# EAGLE design power-volume-video-switching (EAGLE 9.1.0)
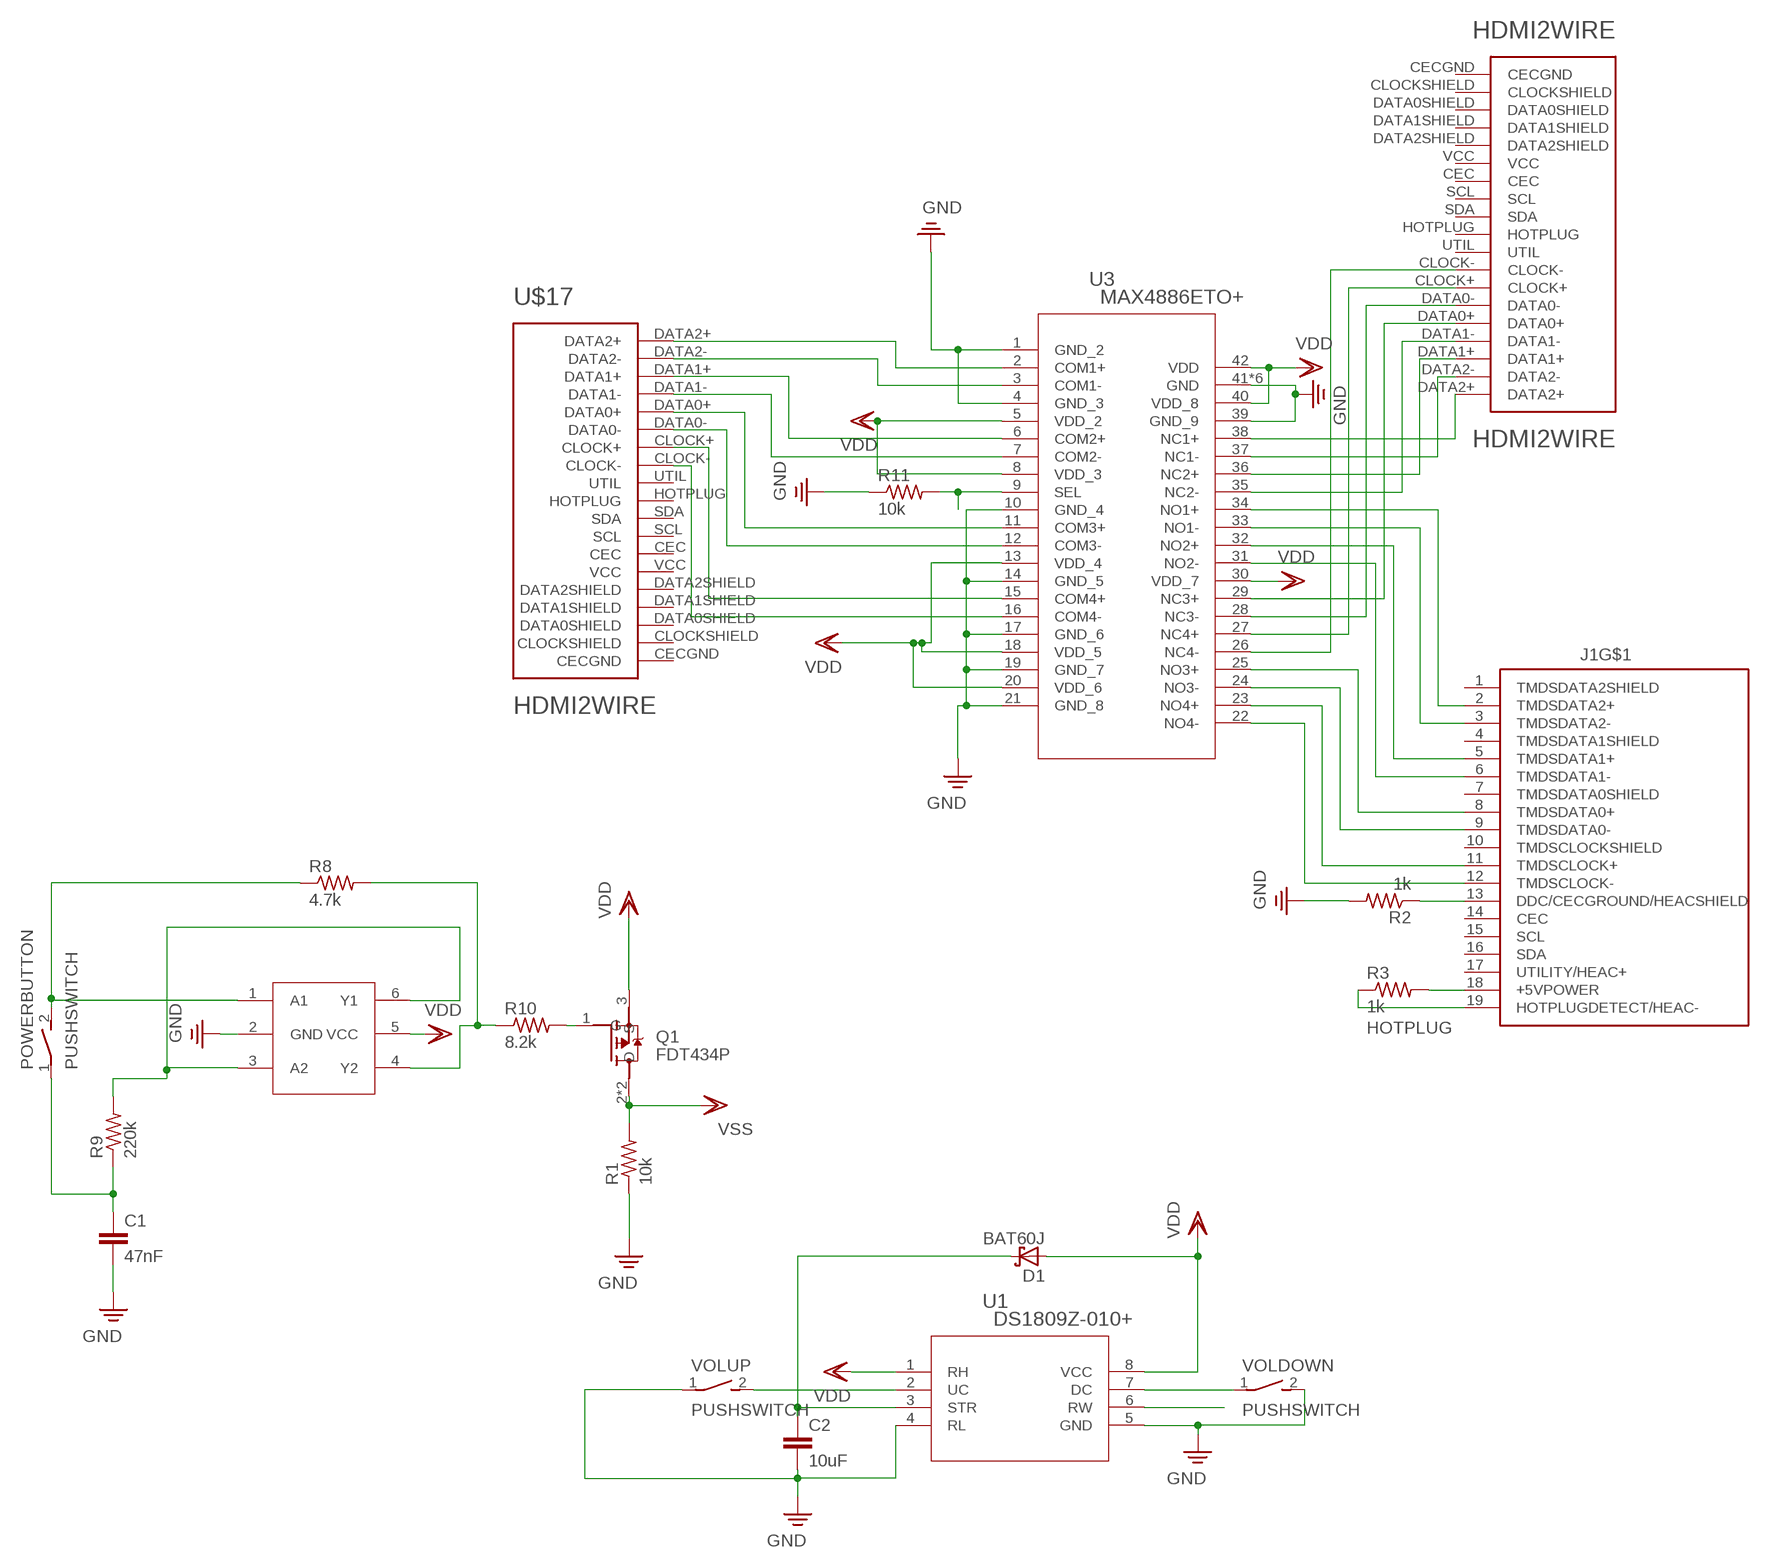
[diagram p0: schematic, sheet 1]

## Parts
C1  47nF  C-EUC0603  [C0603]
C2  10uF  C-EUC0603  [C0603]
D1  BAT60J  [SOD323_ST]
HDMI2WIRE  HDMI2WIRE  [HDMI]
J1  685119136923  [685119136923]
POWERBUTTON  PUSHSWITCH  [PUSHSWITCH]
Q1  FDT434P  [SOT230P700X180-4N]
R1  10k  R-US_R0603  [R0603]
R2  1k  R-US_R0603  [R0603]
R3  1k  R-US_R0603  [R0603]
R8  4.7k  R-US_R0603  [R0603]
R9  220k  R-US_R0603  [R0603]
R10  8.2k  R-US_R0603  [R0603]
R11  10k  R-US_R0603  [R0603]
U1  DS1809Z-010+  [21-0041B_8]
U2  NC7WZ14P6X  [SC70-6L]
U3  MAX4886ETO+  [21-0181B_T423590M-1]
U$17  HDMI2WIRE  [HDMI]
VOLDOWN  PUSHSWITCH  [PUSHSWITCH]
VOLUP  PUSHSWITCH  [PUSHSWITCH]

## Nets
HOTPLUG: J1.19(HOTPLUGDETECT/HEAC-) R3.1 R11.2 U3.9(SEL)
N$1: C2.1 D1.C U1.3(STR)
N$2: U1.2(UC) VOLUP.2(S)
N$3: R9.2 U2.3(A2) U2.6(Y1)
N$4: POWERBUTTON.2(S) R8.1 U2.1(A1)
N$5: J1.2(TMDSDATA2+) U3.34(NO1+)
N$6: U1.7(DC) VOLDOWN.1(P)
N$7: J1.3(TMDSDATA2-) U3.33(NO1-)
N$8: J1.5(TMDSDATA1+) U3.32(NO2+)
N$9: R8.2 R10.1 U2.4(Y2)
N$10: J1.6(TMDSDATA1-) U3.31(NO2-)
N$11: C1.1 POWERBUTTON.1(P) R9.1
N$12: J1.8(TMDSDATA0+) U3.25(NO3+)
N$13: J1.9(TMDSDATA0-) U3.24(NO3-)
N$14: Q1.1(G) R10.2
N$15: J1.11(TMDSCLOCK+) U3.23(NO4+)
N$16: J1.12(TMDSCLOCK-) U3.22(NO4-)
N$17: U3.2(COM1+) U$17.DATA2+
N$18: J1.13(DDC/CECGROUND/HEACSHIELD) R2.1
N$19: U3.3(COM1-) U$17.DATA2-
N$20: J1.18(+5VPOWER) R3.2
N$21: U3.6(COM2+) U$17.DATA1+
N$22: U3.7(COM2-) U$17.DATA1-
N$23: U3.11(COM3+) U$17.DATA0+
N$24: U3.12(COM3-) U$17.DATA0-
N$25: U3.15(COM4+) U$17.CLOCK+
N$26: U3.16(COM4-) U$17.CLOCK-
N$38: HDMI2WIRE.DATA2+ U3.38(NC1+)
N$39: HDMI2WIRE.DATA2- U3.37(NC1-)
N$40: HDMI2WIRE.DATA1+ U3.36(NC2+)
N$41: HDMI2WIRE.DATA1- U3.35(NC2-)
N$42: HDMI2WIRE.DATA0+ U3.29(NC3+)
N$43: HDMI2WIRE.DATA0- U3.28(NC3-)
N$44: HDMI2WIRE.CLOCK+ U3.27(NC4+)
N$45: HDMI2WIRE.CLOCK- U3.26(NC4-)
PE: C1.2 C2.2 R1.1 R2.2 R11.1 U1.4(RL) U1.5(GND) U2.2(GND) U3.1(GND_2) U3.4(GND_3) U3.10(GND_4) U3.14(GND_5) U3.17(GND_6) U3.19(GND_7) U3.21(GND_8) U3.39(GND_9) U3.41(GND) U3.43(GND) U3.P$1(GND) U3.P$2(GND) U3.P$3(GND) U3.P$4(GND) VOLDOWN.2(S) VOLUP.1(P) ; supply symbol labelled GND
VDD: D1.A Q1.3(S) U1.1(RH) U1.8(VCC) U2.5(VCC) U3.5(VDD_2) U3.8(VDD_3) U3.13(VDD_4) U3.18(VDD_5) U3.20(VDD_6) U3.30(VDD_7) U3.40(VDD_8) U3.42(VDD)
VSS: Q1.2(D) Q1.4(D) R1.2
WIPER: U1.6(RW)
Unconnected: HDMI2WIRE.CEC HDMI2WIRE.CECGND HDMI2WIRE.CLOCKSHIELD HDMI2WIRE.DATA0SHIELD HDMI2WIRE.DATA1SHIELD HDMI2WIRE.DATA2SHIELD HDMI2WIRE.HOTPLUG HDMI2WIRE.SCL HDMI2WIRE.SDA HDMI2WIRE.UTIL HDMI2WIRE.VCC J1.1(TMDSDATA2SHIELD) J1.4(TMDSDATA1SHIELD) J1.7(TMDSDATA0SHIELD) J1.10(TMDSCLOCKSHIELD) J1.14(CEC) J1.15(SCL) J1.16(SDA) J1.17(UTILITY/HEAC+) J1.SHELL1(SHIELD) J1.SHELL2(SHIELD) J1.SHELL3(SHIELD) J1.SHELL(SHIELD) U$17.CEC U$17.CECGND U$17.CLOCKSHIELD U$17.DATA0SHIELD U$17.DATA1SHIELD U$17.DATA2SHIELD U$17.HOTPLUG U$17.SCL U$17.SDA U$17.UTIL U$17.VCC

## Library data of the parts
C1 = resistor:C-EU: CAPACITOR, European symbol
C2 = rcl:C-EU: CAPACITOR, European symbol; SPICEPREFIX: C
D1 = diode:BAT60J: Schottky barrier diode Source: www.st.com, BAT60J.pdf
HDMI2WIRE U$17 = wiip:HDMI2WIRE
J1 = InputOutputIO (rev18a):685119136923: WR-COM SMT Horizontal Mini HDMI, 19 pins=>Code : Con_I-O_COM_Mini-HDMI_685119136923 <http://katalog.we-online.de/media/images/eican/Con_I-O_COM_Mini-HDMI_685119136923_pf2.jpg> Details see: http://katalog.we-online.de/en/em/COM_MINI_SMT_HORIZONTAL/685119136923 Created 2014-07-09, Karrer Zheng 2014 (C) Würth Elektronik
POWERBUTTON VOLDOWN VOLUP = wiip:PUSHSWITCH
Q1 = FDT434P:FDT434P: P-Channel 20 V 0.05 Ohm PowerTrench Mosfet - SOT-223; DESCRIPTION: P-Channel 20 V 0.05 Ohm PowerTrench Mosfet - SOT-223; DIGI-KEY_PART_NUMBER: FDT434PCT-ND; DIGI-KEY_PURCHASE_URL: https://www.digikey.com/product-detail/en/on-semiconductor/FDT434P/FDT434PCT-ND/1849925?utm_source=snapeda&utm_medium=aggregator&utm_campaign=symbol; MF: ON Semiconductor; MP: FDT434P; PACKAGE: TO-261-4 ON Semiconductor
R1-R3 R8-R11 = rcl:R-US_: RESISTOR, American symbol; SPICEPREFIX: R
U1 = DS1809Z-010+:DS1809Z-010+; MANUFACTURER_PART_NUMBER: DS1809Z010+; VENDOR: Maxim Integrated Products
U2 = wiip:NC7WZ14P6X
U3 = MAX4886:MAX4886ETO+; MANUFACTURER_PART_NUMBER: MAX4886ETO+; VENDOR: Maxim Integrated Products

## Net classes
0 default: width 0.178 mm, drill 0.254 mm, clearance 0.178 mm

## Board
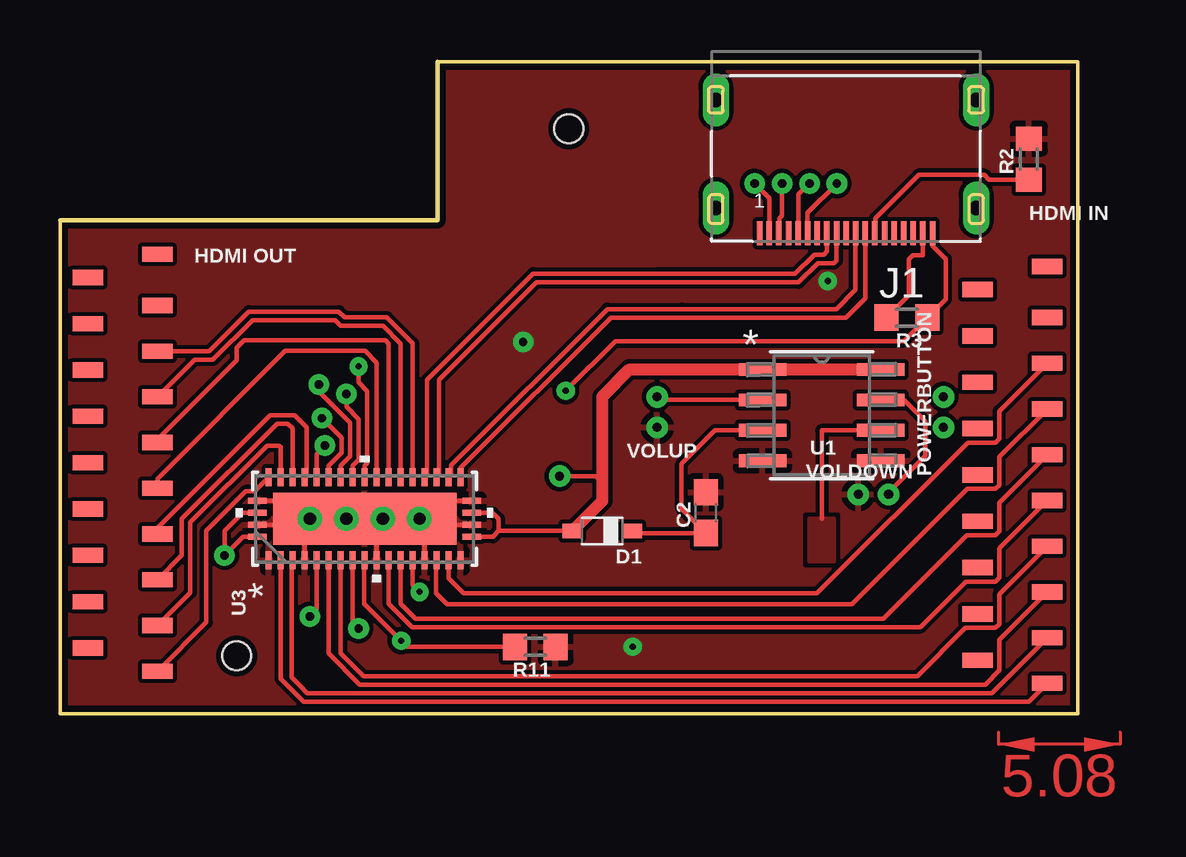
[diagram p1: board, top side]
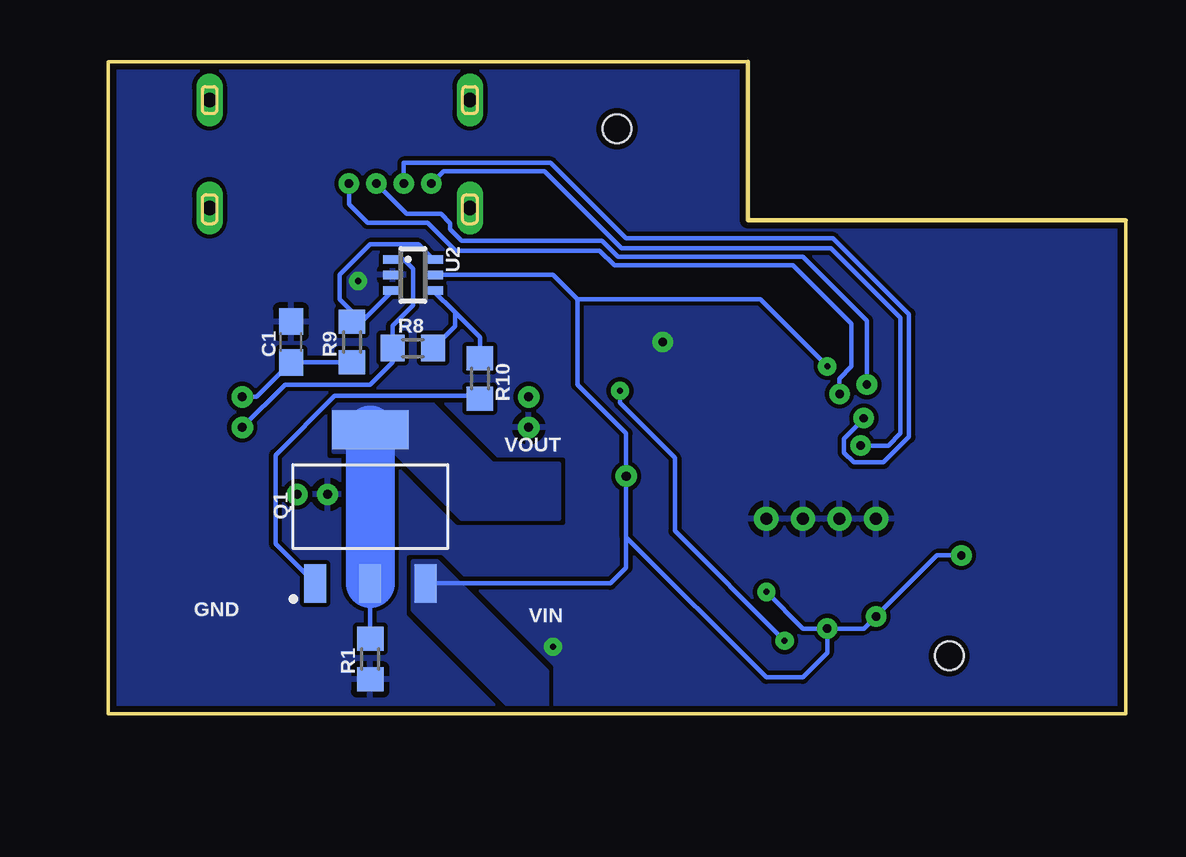
[diagram p2: board, bottom side, seen from below]

Size 42.42 x 27.18 mm. Coordinates in mm from the lower left corner, seen from the top.
Outline: 15.75,27.18 42.42,27.18 42.42,0 0,0 0,20.57 15.75,20.57 15.75,27.18
Copper layers (1*16): Top 0.035mm / dielectric 1.5mm / Bottom 0.035mm
Design rules "oshpark_mini_hdmi *": minimum track width 7mil, minimum drill 10mil, track to track 6mil, track to pad 6mil, pad to pad 7mil, via to via 6mil, smd to smd 4mil, copper to edge 10mil, drill to drill 7mil, minimum pad ring 10mil, minimum via ring 10mil, stop-mask expansion 2mil, vias tented up to drill 0mil, thermal gap 10mil
Holes 1.19 mm at 7.37,2.41 21.21,24.38

### Footprints (pad centres in the part's own frame; a part is rotated, then mirrored left to right if it is on the bottom)
C0603 = smd 1.1 x 1: 1 -0.85,0; 2 0.85,0
SOD323_ST = smd 0.8 x 0.6: A 1.25,0; C -1.25,0
HDMI = smd 1.27 x 0.635: CEC 2.896,-4.826; CECGND 2.896,-16.408; CLOCK+ 0,-11.43; CLOCK- 0,-13.335; CLOCKSHIELD 2.896,-14.478; DATA0+ 0,-7.62; DATA0- 0,-9.525; DATA0SHIELD 2.896,-12.548; DATA1+ 0,-3.81; DATA1- 0,-5.715; DATA1SHIELD 2.896,-10.617; DATA2+ 0,0; DATA2- 0,-1.905; DATA2SHIELD 2.896,-8.687; HOTPLUG 0,-17.374; SCL 2.896,-2.896; SDA 2.896,-0.965; UTIL 0,-15.24; VCC 2.896,-6.756
685119136923 = smd 0.23 x 1: 1 3.6,1.05; 2 3.2,1.05; 3 2.8,1.05; 4 2.4,1.05; 5 2,1.05; 6 1.6,1.05; 7 1.2,1.05; 8 0.8,1.05; 9 0.4,1.05; 10 0,1.05; 11 -0.4,1.05; 12 -0.8,1.05; 13 -1.2,1.05; 14 -1.6,1.05; 15 -2,1.05; 16 -2.4,1.05; 17 -2.8,1.05; 18 -3.2,1.05; 19 -3.6,1.05 | drill 0.6 long: SHELL -5.425,0; SHELL1 5.425,0; SHELL2 -5.425,-4.5; SHELL3 5.425,-4.5
PUSHSWITCH = drill 0.381: 1 0,0; 2 1.27,0
SOT230P700X180-4N = smd 0.92 x 1.61: 1 -2.3,-3.2; 2 0,-3.2; 3 2.3,-3.2 | smd 3.19 x 1.61: 4 0,3.2
R0603 = smd 1 x 1.1: 1 -0.85,0; 2 0.85,0
21-0041B_8 = smd 1.981 x 0.533: 1 -2.464,1.905; 2 -2.464,0.635; 3 -2.464,-0.635; 4 -2.464,-1.905; 5 2.464,-1.905; 6 2.464,-0.635; 7 2.464,0.635; 8 2.464,1.905
SC70-6L = smd 0.35 x 0.8: 1 -0.65,-0.85; 2 0,-0.85; 3 0.65,-0.85; 4 0.65,0.85; 5 0,0.85; 6 -0.65,0.85
21-0181B_T423590M-1 = smd 0.762 x 0.254: 1 -1.727,4; 2 -1.727,3.5; 3 -1.727,3; 4 -1.727,2.5; 5 -1.727,2; 6 -1.727,1.5; 7 -1.727,1; 8 -1.727,0.5; 9 -1.727,0; 10 -1.727,-0.5; 11 -1.727,-1; 12 -1.727,-1.5; 13 -1.727,-2; 14 -1.727,-2.5; 15 -1.727,-3; 16 -1.727,-3.5; 17 -1.727,-4; 22 1.727,-4; 23 1.727,-3.5; 24 1.727,-3; 25 1.727,-2.5; 26 1.727,-2; 27 1.727,-1.5; 28 1.727,-1; 29 1.727,-0.5; 30 1.727,0; 31 1.727,0.5; 32 1.727,1; 33 1.727,1.5; 34 1.727,2; 35 1.727,2.5; 36 1.727,3; 37 1.727,3.5; 38 1.727,4 | smd 0.254 x 0.762: 18 -0.75,-4.47; 19 -0.25,-4.47; 20 0.25,-4.47; 21 0.75,-4.47; 39 0.75,4.47; 40 0.25,4.47; 41 -0.25,4.47; 42 -0.75,4.47 | smd 2.159 x 7.645: 43 0,0 | drill 0.508: P$1 0,2.286; P$2 0,0.762; P$3 0,-0.762; P$4 0,-2.286

### Placement (x,y rotation side)
C1  34.8,15.49 90 bottom
C2  26.92,8.38 90 top
D1  22.61,7.62 180 top
HDMI2WIRE  4.06,1.78 180 top
J1  32.77,21.08 180 top
POWERBUTTON  36.83,13.21 270 bottom
Q1  31.5,8.64 0 bottom
R1  31.5,2.29 90 bottom
R2  40.39,23.11 90 top
R3  35.31,16.51 180 top
R8  29.72,15.24 0 bottom
R9  32.26,15.49 90 bottom
R10  26.92,13.97 270 bottom
R11  19.81,2.79 180 top
U1  31.75,12.45 0 top
U2  29.72,18.29 270 bottom
U3  12.7,8.13 90 top
U$17  41.15,1.27 180 top
VOLDOWN  34.54,9.14 180 top
VOLUP  24.89,11.94 90 bottom

### Tracks (layer width: path | path; a pad name or v marks a point on that pad's centre or on a via)
HOTPLUG  (via drill 0.25)
  Top 0.178: R11.2 14.48,2.79 v14.22,3.05 12.68,4.6 12.68,6.38 U3.9 | v21.08,13.46 23.15,15.53 35.18,15.53 R3.1 36.92,17.28 36.92,18.95 36.37,19.5 J1.19
  Bottom 0.178: v21.08,13.46 21.08,12.95 18.8,10.67 18.8,7.62 v14.22,3.05
N$1
  Top 0.178: U1.3 27.31,11.81 25.91,10.41 25.91,8.55 C2.1 23.94,7.53 D1.C
N$2
  Top 0.178: U1.2 25.02,13.08 VOLUP.2
N$3
  Bottom 0.178: R9.2 31.86,16.34 | 31.86,16.34 R9.2 | U2.6 29.49,19.56 31.5,19.56 32.77,18.29 32.77,17.27 32.26,16.76 R9.2 | U2.3 31.86,16.34 | 31.86,16.34 R9.2
N$4
  Bottom 0.178: U2.1 30.11,18.94 29.72,18.54 29.72,17.02 30.57,16.17 R8.1 30.57,14.64 31.5,13.72 35.05,13.72 POWERBUTTON.2
N$5  (via drill 0.35)
  Top 0.178: U3.34 10.7,10.83 v11.05,11.18 | v28.96,22.1 29.57,21.49 J1.2
  Bottom 0.178: v11.05,11.18 9.91,11.18 9.4,11.68 9.4,16.5 12.3,19.41 21.03,19.41 24.23,22.61 28.45,22.61 v28.96,22.1
N$6
  Top 0.178: U1.7 35.18,13.08 36.07,12.19 36.07,10.76 34.54,9.24 VOLDOWN.1
N$7  (via drill 0.35)
  Top 0.178: U3.33 11.2,10.34 11.75,10.89 11.75,11.5 v10.92,12.32 | J1.3 29.98,20.05 29.98,20.64 30.1,20.76 v30.1,22.1
  Bottom 0.178: v10.92,12.32 10.92,12.29 11.75,11.46 11.75,10.89 11.34,10.48 10.1,10.48 9.04,11.54 9.04,16.65 12.2,19.81 20.83,19.81 23.98,22.96 30.1,22.96 v30.1,22.1
N$8  (via drill 0.35)
  Top 0.178: U3.32 11.7,10.34 12.1,10.74 12.1,12.12 10.8,13.43 v10.8,13.72 | J1.5 30.78,20.05 30.78,21.64 v31.24,22.1
  Bottom 0.178: v10.8,13.72 10.8,16.38 13.46,19.05 21.18,19.05 21.83,19.71 27.68,19.71 28.16,20.19 28.16,20.44 28.55,20.83 29.97,20.83 v31.24,22.1
N$9
  Bottom 0.178: U2.4 27.97,16.74 | 27.97,16.74 26.92,15.69 R10.1 | R8.2 27.97,16.14 27.97,16.74
N$10  (via drill 0.35)
  Top 0.178: v11.94,13.33 11.94,12.79 12.46,12.27 12.46,10.59 12.2,10.34 U3.31 | v32.39,22.1 31.17,20.88 J1.6
  Bottom 0.178: v11.94,13.33 11.94,13.97 11.43,14.48 11.43,16.26 13.87,18.69 21.32,18.69 21.93,19.3 27.94,19.3 29.11,20.47 31.62,20.47 32.39,21.24 v32.39,22.1
N$11
  Bottom 0.178: R9.1 C1.1 36.23,13.21 POWERBUTTON.1
N$12
  Top 0.178: U3.25 15.31,9.96 15.31,13.92 19.72,18.34 24.89,18.34 30.64,18.34 31.44,19.14 31.84,19.14 31.97,19.27 J1.8
N$13
  Top 0.178: U3.24 15.81,9.96 15.81,13.92 19.87,17.98 30.79,17.98 31.59,18.78 32.26,18.78 32.37,18.89 J1.9
N$14
  Bottom 0.178: R10.2 27.05,13.25 32.98,13.25 35.45,10.78 35.45,7.87 35.45,7.09 Q1.1
N$15
  Top 0.178: U3.23 16.31,9.96 16.31,10.36 22.81,16.87 25.91,16.87 32.37,16.87 33.17,17.66 J1.11
N$16
  Top 0.178: U3.22 16.7,10.25 22.96,16.51 32.77,16.51 33.57,17.31 J1.12
N$17
  Top 0.178: U3.2 9.2,1.47 10.16,0.51 40.39,0.51 U$17.DATA2+
N$18
  Top 0.178: R2.1 38.72,22.26 38.53,22.46 35.8,22.46 33.98,20.64 33.98,20.05 J1.13
N$19
  Top 0.178: U$17.DATA2- 40.07,2.1 38.84,0.86 10.31,0.86 10.03,1.14 9.65,1.52 9.65,6.35 U3.3
N$20
  Top 0.178: J1.18 35.97,19.11 35.55,19.11 35.39,18.95 35.39,17.44 R3.2
N$21
  Top 0.178: U3.6 11.2,2.52 12.5,1.22 38.57,1.22 39.15,1.81 39.15,3.09 U$17.DATA1+
N$22
  Top 0.178: U3.7 11.7,2.52 12.65,1.57 35.74,1.57 37.74,3.58 39,3.58 39.15,3.74 39.15,4.99 U$17.DATA1-
N$23
  Top 0.178: U3.11 13.7,4.59 14.68,3.61 35.87,3.61 37.77,5.51 39,5.51 39.15,5.67 39.15,6.9 U$17.DATA0+
N$24
  Top 0.178: U3.12 14.2,4.59 14.83,3.97 34.32,3.97 37.8,7.44 39,7.44 39.15,7.6 39.15,8.8 U$17.DATA0-
N$25
  Top 0.178: U$17.CLOCK+ 39.15,10.71 39.15,9.53 39,9.37 37.82,9.37 33.02,4.57 17.27,4.57 16.13,4.57 15.68,5.02 15.68,6.38 U3.15
N$26
  Top 0.178: U$17.CLOCK- 39.15,12.61 39.15,11.46 39,11.3 37.85,11.3 31.56,5.02 16.83,5.02 16.2,5.64 U3.16
N$38
  Top 0.178: U3.38 8.12,9.27 7.74,9.27 6.1,7.63 6.1,3.81 HDMI2WIRE.DATA2+
N$39
  Top 0.178: HDMI2WIRE.DATA2- 5.44,5.05 5.44,7.98 8.63,11.18 9.14,11.18 9.2,11.12 U3.37
N$40
  Top 0.178: HDMI2WIRE.DATA1+ 5.08,6.6 5.08,8.13 9.04,12.09 9.5,12.09 9.7,11.89 U3.36
N$41
  Top 0.178: U3.35 10.27,9.93 10.27,11.95 9.78,12.45 8.76,12.45 4.06,7.75 HDMI2WIRE.DATA1-
N$42
  Top 0.178: 12.71,15.13 12.7,15.13 | 12.7,15.13 9.38,15.13 4.06,9.81 HDMI2WIRE.DATA0+ | 12.7,15.13 12.71,15.13 | 12.71,15.13 13.21,14.63 U3.29
N$43
  Top 0.178: U3.28 13.7,15.43 13.57,15.56 7.68,15.56 7.36,15.24 7.36,14.74 4.06,11.44 HDMI2WIRE.DATA0-
N$44
  Top 0.178: U3.27 14.2,15.43 13.46,16.17 11.71,16.17 11.47,16.41 8.02,16.41 6.37,14.76 5.61,14.76 HDMI2WIRE.CLOCK+
N$45
  Top 0.178: HDMI2WIRE.CLOCK- 6.22,15.11 7.87,16.76 11.62,16.76 11.86,16.52 13.62,16.52 14.7,15.44 U3.26
PE  (via drill 0.25, 0.35)
  Top 0.178: U3.10 13.2,7.87 U3.P$3 | U3.14 15.2,7.91 | 15.2,7.91 U3.P$4 15.74,8.88 U3.21 | U3.19 15.24,7.88 15.2,7.91 | U3.39 9.66,8.88 U3.P$1 | U3.4 10.2,7.91 U3.P$1 | U3.41 10.16,7.88 U3.P$1
  other vias: 23.88,2.79 32,18.03 19.3,15.49
  pour Bottom (rank 2): -4.57,28.7 57.15,28.7 57.15,-2.03 -4.57,-2.03
  pour Top (rank 2): -4.83,30.48 58.17,30.48 58.17,-2.03 -4.83,-2.03
VDD  (via drill 0.25, 0.35, 0.38)
  Top 0.178: U3.13 14.7,5.37 v14.99,5.08 | U3.20 18.04,8.38 18.29,8.13 18.29,7.62 | 18.29,7.62 18.05,7.38 U3.18 | v10.41,4.06 10.7,4.35 U3.5 | U3.42 7.63,7.38 v6.86,6.6 6.86,7.62 7.62,8.38 U3.40 | v12.45,3.56 12.2,3.8 U3.8 | 18.29,7.62 D1.A | v20.83,9.91 22.35,9.91 22.61,9.65 | v12.45,14.48 12.45,13.81 12.81,13.45 12.81,10.45 12.7,10.33 U3.30
  Top 0.508: U1.8 U1.1 23.75,14.35 22.61,13.21 22.61,9.65 22.61,8.87 D1.A
  Bottom 0.178: v12.45,3.56 10.92,3.56 v10.41,4.06 7.87,6.6 v6.86,6.6 | v12.45,3.56 13.46,3.56 v14.99,5.08 | Q1.3 21.49,5.44 20.83,6.1 v20.83,9.91 | v12.45,3.56 12.45,2.54 13.46,1.52 14.99,1.52 20.83,7.37 v20.83,9.91 | 22.86,17.27 22.86,16.51 22.86,16 22.86,13.72 20.83,11.68 v20.83,9.91 | 22.86,17.27 23.88,18.29 U2.5 | v12.45,14.48 15.24,17.27 22.86,17.27
  pour Bottom (no thermals): 28.7,6.35 24.13,1.78 24.13,0.25 25.65,0.25 29.72,4.32 29.72,6.35
VSS
  Bottom 0.178: Q1.2 R1.2
  Bottom 2.032: Q1.4 Q1.2
  pour Bottom (no thermals): 33.02,12.95 28.96,12.95 26.42,10.41 23.62,10.41 23.62,8.13 27.69,8.13 30.48,10.92 33.02,10.92
WIPER
  Top 0.178: U1.6 31.75,11.81 31.75,8.13
  pour Top: 31.24,8.13 32.26,8.13 32.26,6.35 31.24,6.35
(copper drawn outside any net)
  shapes: Top area x1

### Text on the board
tNames: HDMI IN | HDMI OUT
bNames: VOUT | VIN | GND